# EAGLE design sound_amp (EAGLE 9.1.0)
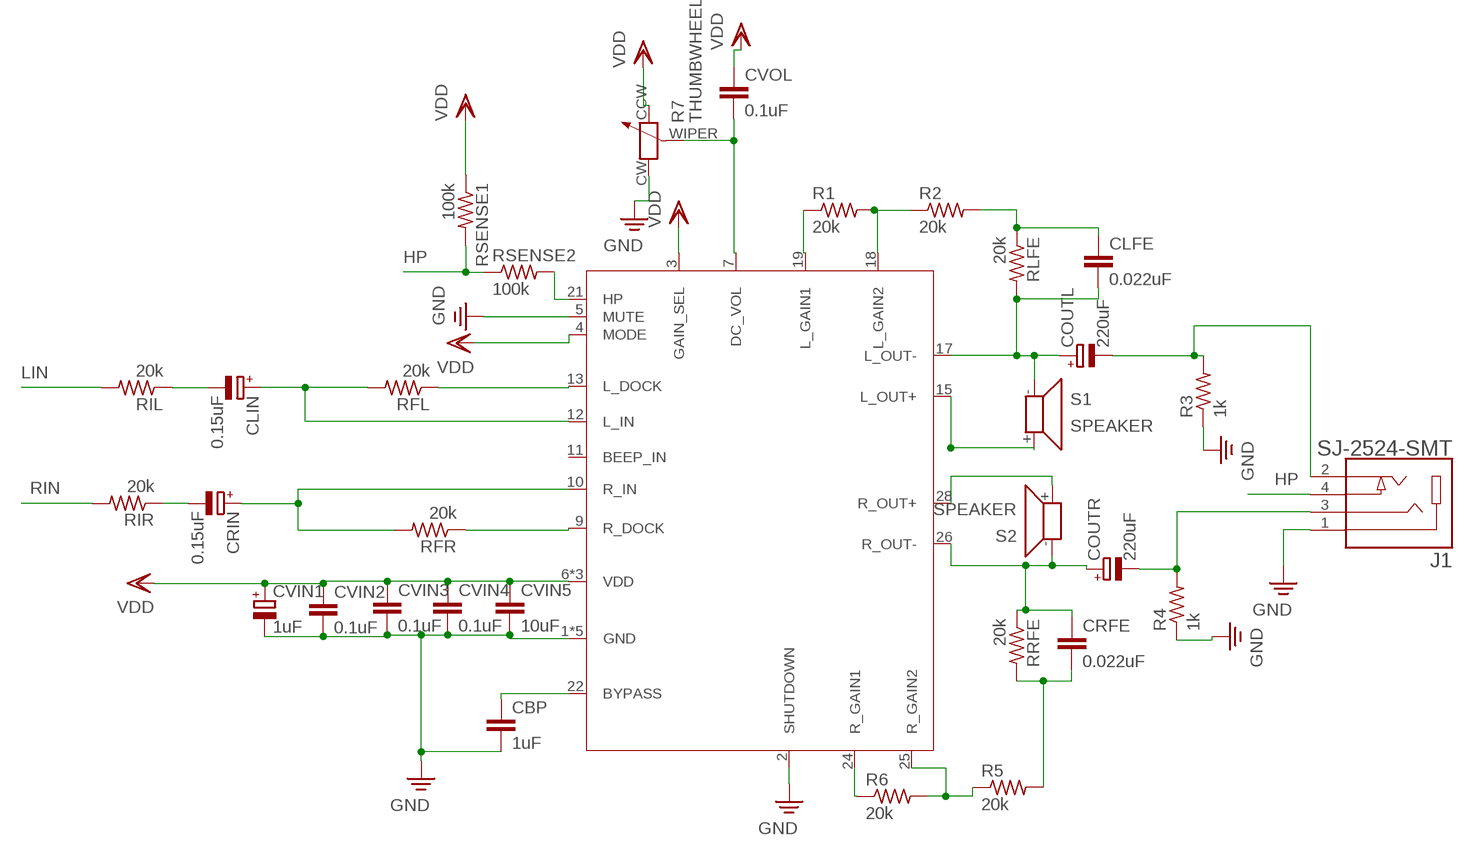
[diagram p0: schematic, sheet 1]

## Parts
CBP  1uF  C-EUC0603  [C0603]
CLFE  0.022uF  C-EUC0603  [C0603]
CLIN  0.15uF  CPOL-EUB45181A  [B45181A]
COUTL  220uF  CPOL-EUB45181A  [B45181A]
COUTR  220uF  CPOL-EUB45181A  [B45181A]
CRFE  0.022uF  C-EUC0603  [C0603]
CRIN  0.15uF  CPOL-EUB45181A  [B45181A]
CVIN1  1uF  CPOL-EUB45181A  [B45181A]
CVIN2  0.1uF  C-EUC0603  [C0603]
CVIN3  0.1uF  C-EUC0603  [C0603]
CVIN4  0.1uF  C-EUC0603  [C0603]
CVIN5  10uF  C-EUC0603  [C0603]
CVOL  0.1uF  C-EUC0603  [C0603]
J1  SJ-2524-SMT  [CUI_SJ-2524-SMT]
R1  20k  R-US_R0603  [R0603]
R2  20k  R-US_R0603  [R0603]
R3  1k  R-US_R0603  [R0603]
R4  1k  R-US_R0603  [R0603]
R5  20k  R-US_R0603  [R0603]
R6  20k  R-US_R0603  [R0603]
R7  THUMBWHEEL  [THUMBWHEEL]
RFL  20k  R-US_R0603  [R0603]
RFR  20k  R-US_R0603  [R0603]
RIL  20k  R-US_R0603  [R0603]
RIR  20k  R-US_R0603  [R0603]
RLFE  20k  R-US_R0603  [R0603]
RRFE  20k  R-US_R0603  [R0603]
RSENSE1  100k  R-US_R0603  [R0603]
RSENSE2  100k  R-US_R0603  [R0603]
S1  SPEAKER  [SIGNALOUT]
S2  SPEAKER  [SIGNALOUT]
U1  LM4835  [TSSOP-28]

## Nets
BYPASS: CBP.1 U1.22(BYPASS)
GND: CBP.2 CVIN1.- CVIN2.2 CVIN3.2 CVIN4.2 CVIN5.2 J1.1 R3.1 R4.1 R7.CW U1.1(GND) U1.2(SHUTDOWN) U1.5(MUTE) U1.8(GND) U1.14(GND) U1.20(GND) U1.23(GND)
HP: J1.4 RSENSE1.2 RSENSE2.1
LDOCK: RFL.1 U1.13(L_DOCK)
LIN: RIL.2
LOUT+: S1.+ U1.15(L_OUT+)
LOUT-: CLFE.2 COUTL.+ RLFE.2 S1.- U1.17(L_OUT-)
N$1: CLIN.+ RFL.2 U1.12(L_IN)
N$2: CRIN.+ RFR.2 U1.10(R_IN)
N$5: CRIN.- RIR.1
N$6: CLIN.- RIL.1
N$7: CVOL.2 R7.WIPER U1.7(DC_VOL)
N$8: RSENSE2.2 U1.21(HP)
N$10: CLFE.1 R2.2 RLFE.1
N$12: R1.2 R2.1 U1.18(L_GAIN2)
N$13: R1.1 U1.19(L_GAIN1)
N$15: COUTL.- J1.2 R3.2
N$18: COUTR.- J1.3 R4.2
N$20: CRFE.2 R5.2 RRFE.2
RDOCK: RFR.1 U1.9(R_DOCK)
RGAIN1: R6.1 U1.24(R_GAIN1)
RGAIN2: R5.1 R6.2 U1.25(R_GAIN2)
RIN: RIR.2
ROUT+: S2.+ U1.28(R_OUT+)
ROUT-: COUTR.+ CRFE.1 RRFE.1 S2.- U1.26(R_OUT-)
VDD: CVIN1.+ CVIN2.1 CVIN3.1 CVIN4.1 CVIN5.1 CVOL.1 R7.CCW RSENSE1.1 U1.3(GAIN_SEL) U1.4(MODE) U1.6(VDD) U1.16(VDD) U1.27(VDD)
Unconnected: U1.11(BEEP_IN)

## Library data of the parts
CBP CLFE CRFE CVIN2-CVIN5 CVOL = resistor:C-EU: CAPACITOR, European symbol
CLIN COUTL COUTR CRIN CVIN1 = resistor:CPOL-EU: POLARIZED CAPACITOR, European symbol
J1 = SJ-2524-SMT:SJ-2524-SMT: Audio Jack Connector 2.5 mm Surface Mount Stereo Jack, 4 Pin Right-Angle; MF: CUI Inc; STANDARD: Manufacturer recommendations
R1-R6 RFL RFR RIL RIR RLFE RRFE RSENSE1 RSENSE2 = resistor:R-US_: RESISTOR, American symbol
R7 = wiip:THUMBWHEEL
S1 S2 = wiip:SPEAKER
U1 = wiip:LM4835

## Board
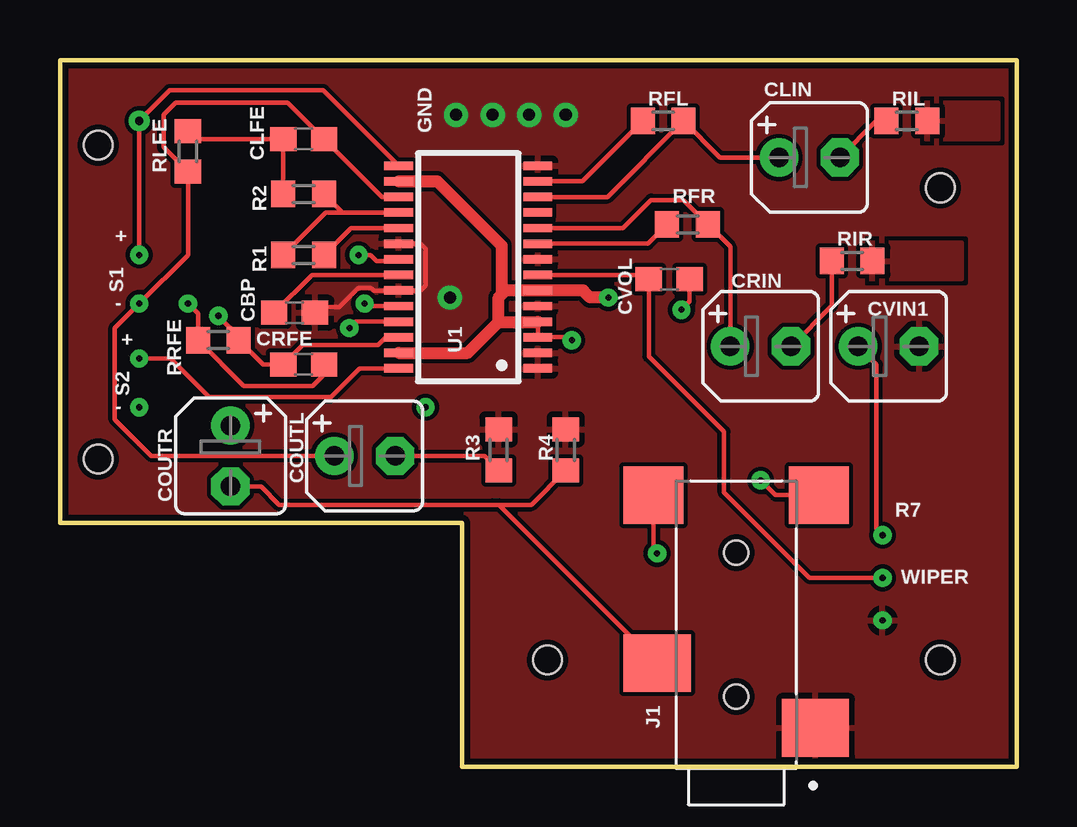
[diagram p1: board, top side]
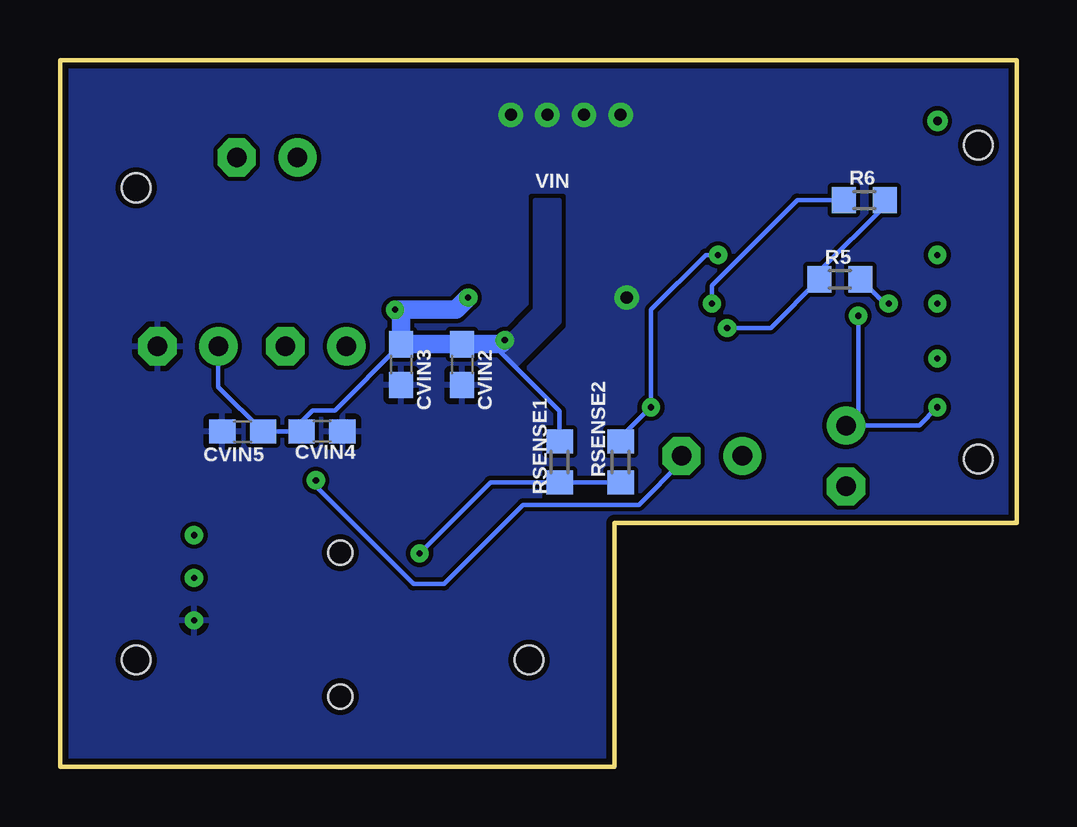
[diagram p2: board, bottom side, seen from below]

Size 39.88 x 29.46 mm. Coordinates in mm from the lower left corner, seen from the top.
Outline: 39.88,29.46 39.88,0 16.76,0 16.76,10.16 0,10.16 0,29.46 39.88,29.46
Copper layers (1*16): Top 0.035mm / dielectric 1.5mm / Bottom 0.035mm
Design rules "oshpark": minimum track width 7mil, minimum drill 10mil, track to track 7mil, track to pad 7mil, pad to pad 7mil, via to via 7mil, smd to smd 6mil, copper to edge 10mil, drill to drill 6mil, minimum pad ring 10mil, minimum via ring 10mil, stop-mask expansion 2mil, vias tented up to drill 0mil, thermal gap 10mil
Holes 1.19 mm at 20.32,4.45 36.7,4.45 36.7,24.13 1.59,25.91 1.59,12.83

### Footprints (pad centres in the part's own frame; a part is rotated, then mirrored left to right if it is on the bottom)
C0603 = smd 1.1 x 1: 1 -0.85,0; 2 0.85,0
B45181A = drill 0.813 pad 1.6: + -1.27,0 | drill 0.813 pad 1.6 octagon: - 1.27,0
CUI_SJ-2524-SMT = smd 2.4 x 2.8: 1 -1.3,-3.3; 3 1.4,3.3 | smd 2.4 x 2.5: 2 8.4,-3.45; 4 8.4,3.45 | hole 1: 0,0; 6,0
R0603 = smd 1 x 1.1: 1 -0.85,0; 2 0.85,0
THUMBWHEEL = drill 0.254: CCW 0,0; CW 3.556,0; WIPER 1.778,0
SIGNALOUT = drill 0.254: + 0,0; - 2.032,0
TSSOP-28 = smd 0.35 x 1.2: 1 -4.225,-2.9; 2 -3.575,-2.9; 3 -2.925,-2.9; 4 -2.275,-2.9; 5 -1.625,-2.9; 6 -0.975,-2.9; 7 -0.325,-2.9; 8 0.325,-2.9; 9 0.975,-2.9; 10 1.625,-2.9; 11 2.275,-2.9; 12 2.925,-2.9; 13 3.575,-2.9; 14 4.225,-2.9; 15 4.225,2.9; 16 3.575,2.9; 17 2.925,2.9; 18 2.275,2.9; 19 1.625,2.9; 20 0.975,2.9; 21 0.325,2.9; 22 -0.325,2.9; 23 -0.975,2.9; 24 -1.625,2.9; 25 -2.275,2.9; 26 -2.925,2.9; 27 -3.575,2.9; 28 -4.225,2.9

### Placement (x,y rotation side)
CBP  9.78,18.92 0 top
CLFE  10.16,26.16 0 top
CLIN  31.24,25.4 0 top
COUTL  12.7,12.95 0 top
COUTR  7.11,12.95 270 top
CRFE  10.16,16.76 0 top
CRIN  29.21,17.53 0 top
CVIN1  34.54,17.53 0 top
CVIN2  23.11,16.76 270 bottom
CVIN3  25.65,16.76 270 bottom
CVIN4  28.96,13.97 0 bottom
CVIN5  32.26,13.97 180 bottom
CVOL  25.4,20.32 180 top
J1  28.19,2.92 90 top
R1  10.16,21.34 180 top
R2  10.16,23.88 180 top
R3  18.29,13.21 270 top
R4  21.08,13.21 270 top
R5  7.37,20.32 0 bottom
R6  6.35,23.62 0 bottom
R7  34.29,9.65 270 top
RFL  25.15,26.92 0 top
RFR  26.16,22.61 0 top
RIL  35.31,26.92 0 top
RIR  33.02,21.08 0 top
RLFE  5.33,25.65 270 top
RRFE  6.6,17.78 180 top
RSENSE1  19.05,12.7 270 bottom
RSENSE2  16.51,12.7 90 bottom
S1  3.3,21.34 270 top
S2  3.3,17.02 270 top
U1  17.02,20.83 90 top

### Tracks (layer width: path | path; a pad name or v marks a point on that pad's centre or on a via)
BYPASS
  Top 0.178: CBP.1 10.51,20.5 U1.22
GND  (via drill 0.51)
  Top 0.178: CBP.2 10.87,19.16 11.64,19.16 12.43,19.95 12.97,19.95 13.07,19.85 U1.23 15.03,19.85 15.24,20.07 15.24,21.59 15.03,21.8 U1.20
  other vias: 16.51,27.18 18.03,27.18 19.56,27.18 21.08,27.18 16.26,19.56
  pour Bottom (rank 2): -8.13,33.78 45.47,33.78 45.47,-4.32 -8.13,-4.32
  pour Top (rank 2): -4.83,32.77 43.69,32.77 43.69,-2.54 -4.83,-2.54
HP  (via drill 0.25)
  Top 0.178: J1.4 24.74,9.04 v24.89,8.89
  Bottom 0.178: RSENSE2.1 RSENSE1.2 21.93,11.85 v24.89,8.89
LDOCK
  Top 0.178: RFL.1 21.77,24.4 U1.13
LIN
  pour Top: 36.07,27.69 39.12,27.69 39.12,26.16 36.07,26.16
LOUT+  (via drill 0.35)
  Top 0.178: U1.15 10.98,28.19 4.57,28.19 v3.3,26.92 S1.+
LOUT-
  Top 0.178: U1.17 13.42,23.75 CLFE.2 9.49,27.69 4.83,27.69 4.32,27.18 4.32,25.82 RLFE.2 5.33,21.34 S1.- 2.29,18.29 2.29,14.48 3.81,12.95 COUTL.+
N$1
  Top 0.178: U1.12 22.82,23.75 RFL.2 27.52,25.4 CLIN.+
N$2
  Top 0.178: U1.10 23.47,22.45 24.64,23.62 26,23.62 RFR.2 27.94,21.68 CRIN.+
N$5
  Top 0.178: RIR.1 32.17,19.22 CRIN.-
N$6
  Top 0.178: RIL.1 34.04,26.92 CLIN.-
N$7
  Top 0.178: U1.7 24.37,20.5 CVOL.2 24.55,17.11 27.69,13.97 27.69,11.43 31.24,7.87 R7.WIPER
N$8  (via drill 0.25)
  Top 0.178: v12.45,21.34 12.95,21.34 13.21,21.08 14.05,21.08 U1.21
  Bottom 0.178: v12.45,21.34 12.95,21.34 15.24,19.05 v15.24,14.99 16.51,13.72 RSENSE2.2
N$10
  Top 0.178: R2.2 CLFE.1 5.68,26.16 RLFE.1
N$12
  Top 0.178: R2.1 11.78,23.1 11.94,23.1 | 11.94,23.1 U1.18 | R1.2 11.08,23.1 11.94,23.1
N$13
  Top 0.178: U1.19 12.13,22.45 R1.1
N$15  (via drill 0.25)
  Top 0.178: COUTL.- 17.69,12.95 R3.2 | v29.21,11.94 29.83,11.32 J1.2
  Bottom 0.178: v29.21,11.94 29.21,11.68 25.15,7.62 23.88,7.62 20.57,10.92 15.75,10.92 13.97,12.7 COUTL.-
N$18
  Top 0.178: COUTR.- 8.38,11.68 9.14,10.92 18.03,10.92 | 18.03,10.92 19.65,10.92 R4.2 | J1.3 18.29,10.92 18.03,10.92
N$20  (via drill 0.25)
  Top 0.178: CRFE.2 11.01,16.34 10.54,15.88 7.66,15.88 RRFE.2 5.75,18.88 v5.33,19.3
  Bottom 0.178: R5.2 5.5,19.3 v5.33,19.3
RDOCK
  Top 0.178: U1.9 24.51,21.8 RFR.1
RGAIN1  (via drill 0.25)
  Top 0.178: v12.7,19.3 12.8,19.2 U1.24
  Bottom 0.178: R6.1 9.14,23.62 12.7,20.07 v12.7,19.3
RGAIN2  (via drill 0.25)
  Top 0.178: v12.06,18.29 12.33,18.55 U1.25
  Bottom 0.178: v12.06,18.29 10.25,18.29 R5.1 8.22,20.65 5.5,23.37 R6.2
RIN
  pour Top: 33.53,21.84 37.59,21.84 37.59,20.32 33.53,20.32
ROUT+
  Top 0.178: S2.+ 4.62,17.02 6.22,15.42 11.31,15.42 12.49,16.6 U1.28
ROUT-  (via drill 0.25)
  Top 0.178: RRFE.1 7.54,17.7 | 7.54,17.7 8.47,16.76 CRFE.1 10.12,17.57 13.25,17.57 13.58,17.9 U1.26 | v6.6,18.8 7.54,17.86 7.54,17.7
  Bottom 0.178: v6.6,18.8 6.6,14.73 COUTR.+ 4.06,14.22 S2.-
VDD  (via drill 0.25)
  Top 0.178: v21.34,17.78 21.21,17.9 U1.3 19.92,18.54 U1.4 | R7.CCW 34.04,9.91 34.04,16.76 CVIN1.+ | v25.91,19.05 26.25,19.39 CVOL.1 | U1.6 19.88,19.81 U1.6
  Top 0.508: 18.41,19.69 18.58,19.85 U1.6 21.8,19.85 22.1,19.56 v22.86,19.56 | 18.29,18.54 19.92,18.54 | U1.16 15.73,24.4 18.41,21.72 18.41,19.69 | U1.27 17,17.25 18.29,18.54 | 18.29,18.54 18.29,19.56 18.41,19.69
  Bottom 0.178: v21.34,17.78 21.5,17.61 21.84,17.61 19.05,14.82 RSENSE1.1 | CVIN1.+ 33.27,15.84 CVIN5.1 CVIN4.1 29.81,14.39 29.34,14.86 28.41,14.86 25.7,17.57 CVIN3.1 25.65,17.78
  Bottom 0.762: v21.34,17.78 21.5,17.61 CVIN2.1 CVIN3.1 | CVIN3.1 25.7,17.57 | CVIN3.1 25.65,18.8 v25.91,19.05 23.37,19.05 v22.86,19.56
  pour Bottom: 21.34,17.78 20.07,19.05 20.07,23.62 19.05,23.62 19.05,18.54 20.83,16.76 21.59,17.53

### Text on the board
tNames: GND | + | - | + | - | WIPER
bNames: VIN